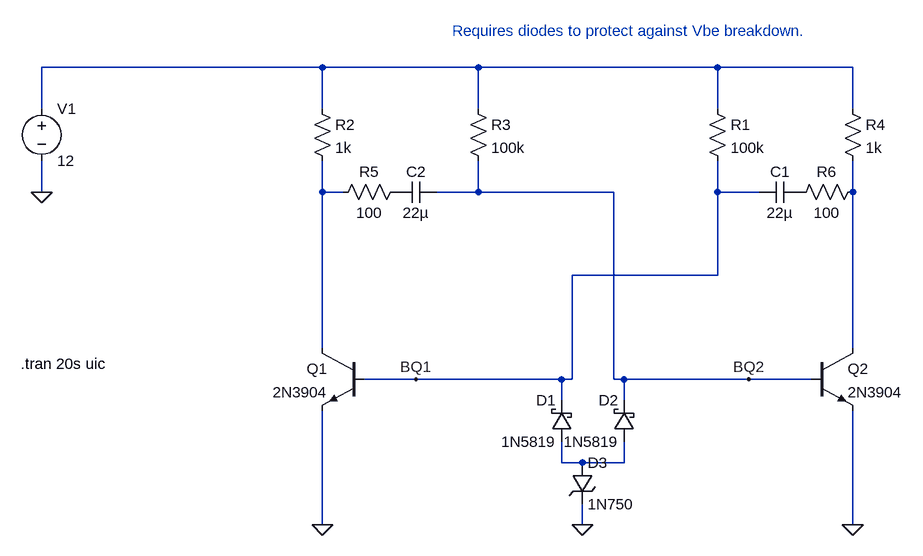
[diagram p0: schematic discrete_V1.asc]
discrete_V1.asc, the LTspice schematic file:
Version 4
SHEET 1 1144 740
WIRE 224 0 -208 0
WIRE 464 0 224 0
WIRE 832 0 464 0
WIRE 1040 0 832 0
WIRE -208 64 -208 0
WIRE 224 64 224 0
WIRE 464 64 464 0
WIRE 832 64 832 0
WIRE 1040 64 1040 0
WIRE -208 192 -208 144
WIRE 224 192 224 144
WIRE 256 192 224 192
WIRE 464 192 464 144
WIRE 464 192 400 192
WIRE 672 192 464 192
WIRE 832 192 832 144
WIRE 896 192 832 192
WIRE 1040 192 1040 144
WIRE 832 320 832 192
WIRE 832 320 608 320
WIRE 224 432 224 192
WIRE 1040 432 1040 192
WIRE 368 480 288 480
WIRE 592 480 368 480
WIRE 608 480 608 320
WIRE 608 480 592 480
WIRE 672 480 672 192
WIRE 688 480 672 480
WIRE 880 480 688 480
WIRE 976 480 880 480
WIRE 592 512 592 480
WIRE 688 512 688 480
WIRE 592 608 592 576
WIRE 624 608 592 608
WIRE 688 608 688 576
WIRE 688 608 624 608
WIRE 224 704 224 528
WIRE 624 704 624 672
WIRE 1040 704 1040 528
FLAG -208 192 0
FLAG 224 704 0
FLAG 1040 704 0
FLAG 880 480 BQ2
FLAG 368 480 BQ1
FLAG 624 704 0
SYMBOL res 816 48 R0
SYMATTR InstName R1
SYMATTR Value 100k
SYMBOL res 208 48 R0
SYMATTR InstName R2
SYMATTR Value 1k
SYMBOL res 448 48 R0
SYMATTR InstName R3
SYMATTR Value 100k
SYMBOL res 1024 48 R0
SYMATTR InstName R4
SYMATTR Value 1k
SYMBOL voltage -208 48 R0
WINDOW 123 0 0 Left 0
WINDOW 39 0 0 Left 0
SYMATTR InstName V1
SYMATTR Value 12
SYMBOL npn 288 432 M0
SYMATTR InstName Q1
SYMATTR Value 2N3904
SYMBOL npn 976 432 R0
SYMATTR InstName Q2
SYMATTR Value 2N3904
SYMBOL cap 400 176 R90
WINDOW 0 0 32 VBottom 2
WINDOW 3 32 32 VTop 2
SYMATTR InstName C2
SYMATTR Value 22µ
SYMBOL cap 960 176 R90
WINDOW 0 0 32 VBottom 2
WINDOW 3 32 32 VTop 2
SYMATTR InstName C1
SYMATTR Value 22µ
SYMBOL zener 608 608 R0
SYMATTR InstName D3
SYMATTR Value 1N750
SYMATTR Description Diode
SYMATTR Type diode
SYMBOL res 352 176 R90
WINDOW 0 0 56 VBottom 2
WINDOW 3 32 56 VTop 2
SYMATTR InstName R5
SYMATTR Value 100
SYMBOL res 1056 176 R90
WINDOW 0 0 56 VBottom 2
WINDOW 3 32 56 VTop 2
SYMATTR InstName R6
SYMATTR Value 100
SYMBOL schottky 608 576 R180
WINDOW 0 24 64 Left 2
WINDOW 3 24 0 Left 2
SYMATTR InstName D1
SYMATTR Value 1N5819
SYMATTR Description Diode
SYMATTR Type diode
SYMBOL schottky 704 576 R180
WINDOW 0 24 64 Left 2
WINDOW 3 24 0 Left 2
SYMATTR InstName D2
SYMATTR Value 1N5819
SYMATTR Description Diode
SYMATTR Type diode
TEXT -240 456 Left 2 !.tran 20s uic
TEXT 424 -56 Left 2 ;Requires diodes to protect against Vbe breakdown.

The netlist it stands for:
* discrete_V1.asc
R1 N001 BQ1 100k
R2 N001 N002 1k
R3 N001 BQ2 100k
R4 N001 N003 1k
V1 N001 0 12
Q1 N002 BQ1 0 0 2N3904
Q2 N003 BQ2 0 0 2N3904
C2 BQ2 P001 22µ
C1 P002 BQ1 22µ
D3 N004 0 1N750
R5 P001 N002 100
R6 N003 P002 100
D1 N004 BQ1 1N5819
D2 N004 BQ2 1N5819
.model D D
.lib standard.dio
.model NPN NPN
.model PNP PNP
.lib standard.bjt
.tran 20s uic
* Requires diodes to protect against Vbe breakdown.
.backanno
.end